# EAGLE design mLRS-tx-dualE22-top-v031 (EAGLE 7.5.0)
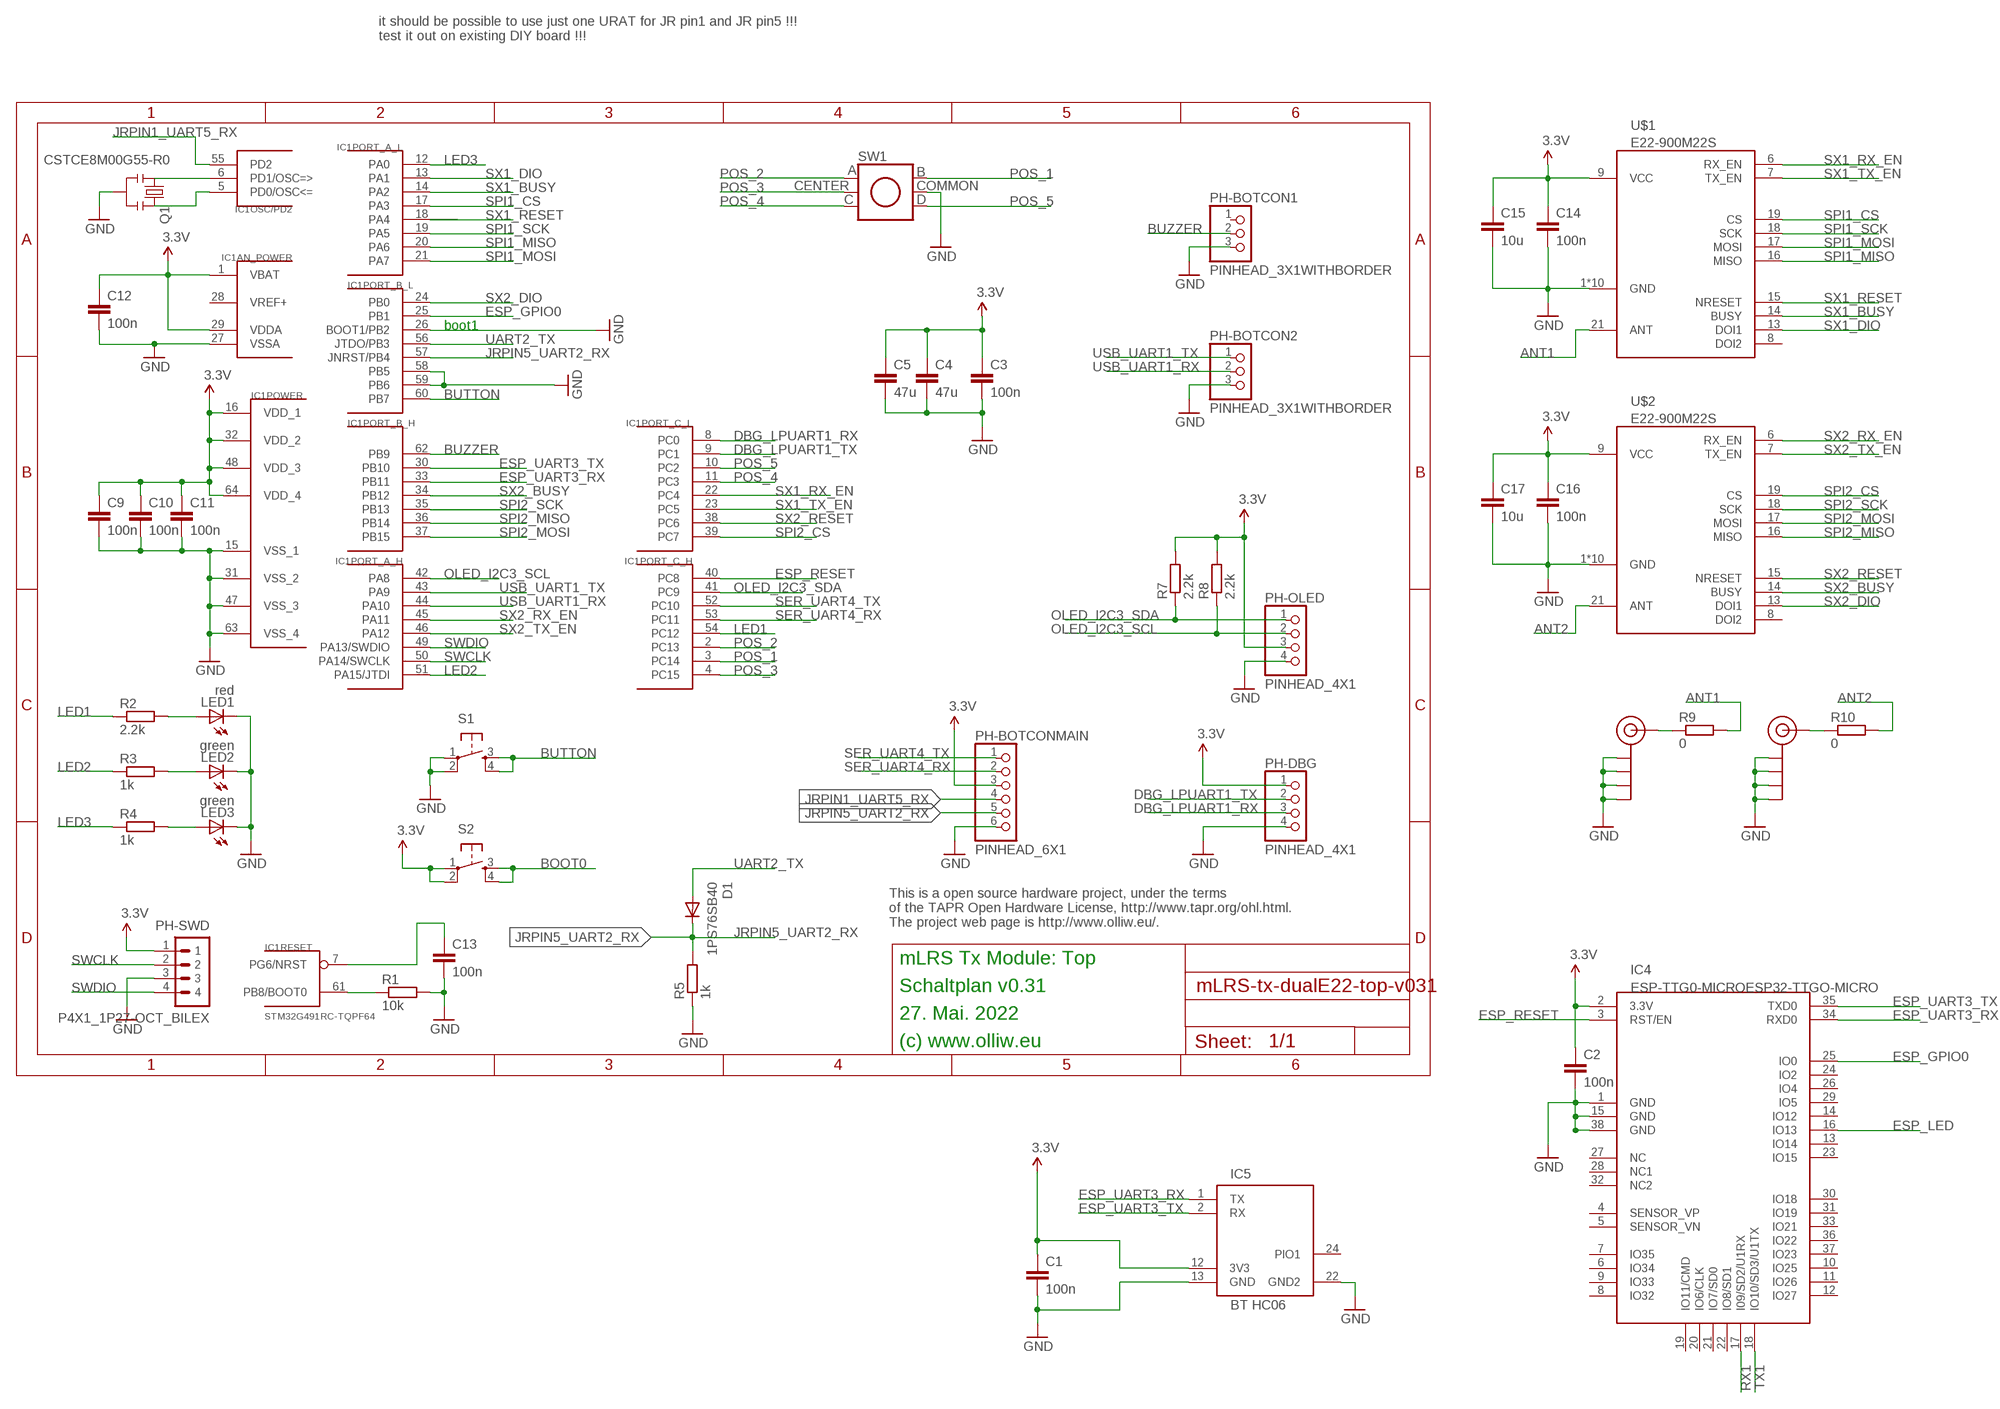
[diagram p0: schematic, sheet 1]

## Parts
C1  100n  C-EUC0603  [C0603]
C2  100n  C-EUC0603  [C0603]
C3  100n  C-EUC0402  [C0402]
C4  47u  C-EUC1210  [C1210]
C5  47u  C-EUC1206K  [C1206K]
C9  100n  C-EUC0402  [C0402]
C10  100n  C-EUC0402  [C0402]
C11  100n  C-EUC0402  [C0402]
C12  100n  C-EUC0402  [C0402]
C13  100n  C-EUC0402  [C0402]
C14  100n  C-EUC0402  [C0402]
C15  10u  C-EUC0603  [C0603]
C16  100n  C-EUC0402  [C0402]
C17  10u  C-EUC0603  [C0603]
D1  1PS76SB40  DIODE-SOD110-R  [SOD110-R]
IC1  STM32G491RC-TQPF64  STM32G4X1RX-TQPF64  [TQFP64]
IC4  ESP-TTG0-MICROESP32-TTGO-MICRO  [ESP32-TTGO-MICRO]
IC5  BT HC06  HC06-BASIC  [BT_HC05_BASIC]
LED1  red  LEDCHIPLED_0603  [CHIPLED_0603]
LED2  green  LEDCHIPLED_0603  [CHIPLED_0603]
LED3  green  LEDCHIPLED_0603  [CHIPLED_0603]
PH-BOTCON1  PINHEAD_3X1WITHBORDER  [PINHEAD_3X1]
PH-BOTCON2  PINHEAD_3X1WITHBORDER  [PINHEAD_3X1]
PH-BOTCONMAIN  PINHEAD_6X1  [PINHEAD_6X1]
PH-DBG  PINHEAD_4X1  [PINHEAD_4X1]
PH-OLED  PINHEAD_4X1  [PINHEAD_4X1]
PH-SWD  P4X1_1P27-OCT_BILEX  [4X1_1P27_OCT_BILEX]
Q1  CSTCE8M00G55-R0  RESONATORSMD  [RESONATOR-SMD]
R1  10k  R-EU_R0402  [R0402]
R2  2.2k  R-EU_R0402  [R0402]
R3  1k  R-EU_R0402  [R0402]
R4  1k  R-EU_R0402  [R0402]
R5  1k  R-EU_R0402  [R0402]
R7  2.2k  R-EU_R0402  [R0402]
R8  2.2k  R-EU_R0402  [R0402]
R9  0  R-EU_R0402  [R0402]
R10  0  R-EU_R0402  [R0402]
RF1  SMA_EDGE  [SMA-EDGE]
RF2  SMA_EDGE  [SMA-EDGE]
S1  TAC_SWITCHPTH  [TACTILE-PTH]
S2  TAC_SWITCHPTH  [TACTILE-PTH]
SW1  JOYSTICK-5WAY  [JOYSTICK-5WAY]
U$1  E22-900M22S  [E22-900M22S]
U$2  E22-900M22S  [E22-900M22S]

## Nets
3.3V: C1.1 C2.1 C3.1 C4.1 C5.1 C9.1 C10.1 C11.1 C12.1 C14.1 C15.1 C16.1 C17.1 IC1.1(AN_POWER:VBAT) IC1.16(POWER:VDD_1) IC1.29(AN_POWER:VDDA) IC1.32(POWER:VDD_2) IC1.48(POWER:VDD_3) IC1.64(POWER:VDD_4) IC4.2(3.3V) IC5.12(3V3) PH-BOTCONMAIN.3 PH-DBG.1 PH-OLED.3 PH-SWD.1 R7.2 R8.2 S2.1 S2.2 U$1.9(VCC) U$2.9(VCC)
ANT1: R9.2 U$1.21(ANT)
ANT2: R10.2 U$2.21(ANT)
BOOT0: IC1.61(RESET:PB8/BOOT0) R1.1 S2.3 S2.4
BUTTON: IC1.60(PORT_B_L:PB7) S1.3 S1.4
BUZZER: IC1.62(PORT_B_H:PB9) PH-BOTCON1.2
DBG_LPUART1_RX: IC1.8(PORT_C_L:PC0) PH-DBG.3
DBG_LPUART1_TX: IC1.9(PORT_C_L:PC1) PH-DBG.2
ESP_GPIO0: IC1.25(PORT_B_L:PB1) IC4.25(IO0)
ESP_LED: IC4.16(IO13)
ESP_RESET: IC1.40(PORT_C_H:PC8) IC4.3(RST/EN)
ESP_UART3_RX: IC1.33(PORT_B_H:PB11) IC4.34(RXD0) IC5.1(TX)
ESP_UART3_TX: IC1.30(PORT_B_H:PB10) IC4.35(TXD0) IC5.2(RX)
GND: C1.2 C2.2 C3.2 C4.2 C5.2 C9.2 C10.2 C11.2 C12.2 C13.2 C14.2 C15.2 C16.2 C17.2 IC1.15(POWER:VSS_1) IC1.26(PORT_B_L:BOOT1/PB2) IC1.27(AN_POWER:VSSA) IC1.31(POWER:VSS_2) IC1.47(POWER:VSS_3) IC1.58(PORT_B_L:PB5) IC1.59(PORT_B_L:PB6) IC1.63(POWER:VSS_4) IC4.1(GND) IC4.15(GND) IC4.38(GND) IC5.13(GND) IC5.22(GND2) LED1.C LED2.C LED3.C PH-BOTCON1.3 PH-BOTCON2.3 PH-BOTCONMAIN.6 PH-DBG.4 PH-OLED.4 PH-SWD.3 Q1.2 R1.2 R5.1 RF1.GND@0(GND) RF1.GND@1(GND) RF1.GND@2(GND) RF1.GND@3(GND) RF2.GND@0(GND) RF2.GND@1(GND) RF2.GND@2(GND) RF2.GND@3(GND) S1.1 S1.2 SW1.5(COMMON) U$1.1(GND) U$1.2(GND) U$1.3(GND) U$1.4(GND) U$1.5(GND) U$1.10(GND) U$1.11(GND) U$1.12(GND) U$1.20(GND) U$1.22(GND) U$2.1(GND) U$2.2(GND) U$2.3(GND) U$2.4(GND) U$2.5(GND) U$2.10(GND) U$2.11(GND) U$2.12(GND) U$2.20(GND) U$2.22(GND)
JRPIN1_UART5_RX: IC1.55(OSC/PD2:PD2) PH-BOTCONMAIN.4
JRPIN5_UART2_RX: D1.C IC1.57(PORT_B_L:JNRST/PB4) PH-BOTCONMAIN.5 R5.2
LED1: IC1.54(PORT_C_H:PC12) R2.1
LED2: IC1.51(PORT_A_H:PA15/JTDI) R3.1
LED3: IC1.12(PORT_A_L:PA0) R4.1
N$1: R9.1 RF1.SIG(SIGNAL)
N$2: R10.1 RF2.SIG(SIGNAL)
N$4: LED1.A R2.2
N$5: C13.1 IC1.7(RESET:PG6/NRST)
N$8: LED2.A R3.2
N$9: LED3.A R4.2
N$12: IC1.5(OSC/PD2:PD0/OSC<=) Q1.3
N$14: IC1.6(OSC/PD2:PD1/OSC=>) Q1.1
OLED_I2C3_SCL: IC1.42(PORT_A_H:PA8) PH-OLED.2 R8.1
OLED_I2C3_SDA: IC1.41(PORT_C_H:PC9) PH-OLED.1 R7.1
POS_1: IC1.3(PORT_C_H:PC14) SW1.4(B)
POS_2: IC1.2(PORT_C_H:PC13) SW1.1(A)
POS_3: IC1.4(PORT_C_H:PC15) SW1.2(CENTER)
POS_4: IC1.11(PORT_C_L:PC3) SW1.3(C)
POS_5: IC1.10(PORT_C_L:PC2) SW1.6(D)
RX1: IC4.17(I09/SD2/U1RX)
SER_UART4_RX: IC1.53(PORT_C_H:PC11) PH-BOTCONMAIN.2
SER_UART4_TX: IC1.52(PORT_C_H:PC10) PH-BOTCONMAIN.1
SPI1_CS: IC1.17(PORT_A_L:PA3) U$1.19(CS)
SPI1_MISO: IC1.20(PORT_A_L:PA6) U$1.16(MISO)
SPI1_MOSI: IC1.21(PORT_A_L:PA7) U$1.17(MOSI)
SPI1_SCK: IC1.19(PORT_A_L:PA5) U$1.18(SCK)
SPI2_CS: IC1.39(PORT_C_L:PC7) U$2.19(CS)
SPI2_MISO: IC1.36(PORT_B_H:PB14) U$2.16(MISO)
SPI2_MOSI: IC1.37(PORT_B_H:PB15) U$2.17(MOSI)
SPI2_SCK: IC1.35(PORT_B_H:PB13) U$2.18(SCK)
SWCLK: IC1.50(PORT_A_H:PA14/SWCLK) PH-SWD.2
SWDIO: IC1.49(PORT_A_H:PA13/SWDIO) PH-SWD.4
SX1_BUSY: IC1.14(PORT_A_L:PA2) U$1.14(BUSY)
SX1_DIO: IC1.13(PORT_A_L:PA1) U$1.13(DOI1)
SX1_RESET: IC1.18(PORT_A_L:PA4) U$1.15(NRESET)
SX1_RX_EN: IC1.22(PORT_C_L:PC4) U$1.6(RX_EN)
SX1_TX_EN: IC1.23(PORT_C_L:PC5) U$1.7(TX_EN)
SX2_BUSY: IC1.34(PORT_B_H:PB12) U$2.14(BUSY)
SX2_DIO: IC1.24(PORT_B_L:PB0) U$2.13(DOI1)
SX2_RESET: IC1.38(PORT_C_L:PC6) U$2.15(NRESET)
SX2_RX_EN: IC1.45(PORT_A_H:PA11) U$2.6(RX_EN)
SX2_TX_EN: IC1.46(PORT_A_H:PA12) U$2.7(TX_EN)
TX1: IC4.18(IO10/SD3/U1TX)
UART2_TX: D1.A IC1.56(PORT_B_L:JTDO/PB3)
USB_UART1_RX: IC1.44(PORT_A_H:PA10) PH-BOTCON2.2
USB_UART1_TX: IC1.43(PORT_A_H:PA9) PH-BOTCON2.1
Unconnected: IC1.28(AN_POWER:VREF+) IC4.4(SENSOR_VP) IC4.5(SENSOR_VN) IC4.6(IO34) IC4.7(IO35) IC4.8(IO32) IC4.9(IO33) IC4.10(IO25) IC4.11(IO26) IC4.12(IO27) IC4.13(IO14) IC4.14(IO12) IC4.19(IO11/CMD) IC4.20(IO6/CLK) IC4.21(IO7/SD0) IC4.22(IO8/SD1) IC4.23(IO15) IC4.24(IO2) IC4.26(IO4) IC4.27(NC) IC4.28(NC1) IC4.29(IO5) IC4.30(IO18) IC4.31(IO19) IC4.32(NC2) IC4.33(IO21) IC4.36(IO22) IC4.37(IO23) IC5.24(PIO1) PH-BOTCON1.1 U$1.8(DOI2) U$2.8(DOI2)

## Notes on the sheet
- it should be possible to use just one URAT for JR pin1 and JR pin5 !!!
  test it out on existing DIY board !!!
- boot1
- This is a open source hardware project, under the terms
  of the TAPR Open Hardware License, http://www.tapr.org/ohl.html.
  The project web page is http://www.olliw.eu/.
- mLRS Tx Module: Top
- Schaltplan v0.31
- 27. Mai. 2022
- (c) www.olliw.eu

## Library data of the parts
C1-C5 C9-C17 = rcl:C-EU: CAPACITOR, European symbol
D1 = diode:DIODE-: DIODE
IC1 = # stm32:STM32G4X1RX
IC4 = # stdlib:ESP-TTG0-MICRO
IC5 = # SerialPortBluetooth:HC06-BASIC
LED1-LED3 = led:LED: LED OSRAM: - CHIPLED LG R971, LG N971, LY N971, LG Q971, LY Q971, LO R971, LY R971 LH N974, LH R974 LS Q976, LO Q976, LY Q976 LO Q996 - Hyper CHIPLED LW Q18S LB Q993, LB Q99A, LB R99A - SideLED LS A670, LO A670, LY A670, LG A670, LP A670 LB A673, LV A673, LT A673, LW A673 LH A674 LY A675 LS A676, LA A676, LO A676, LY A676, LW A676 LS A679, LY A679, LG A679 - Hyper Micro SIDELED® LS Y876, LA Y876, LO Y876, LY Y876 LT Y87S - SmartLED LW L88C, LW L88S LB L89C, LB L89S, LG L890 LS L89K, LO L89K, LY L89K LS L896, LA L896, LO L896, LY L896 - TOPLED LS T670, LO T670, LY T670, LG T670, LP T670 LSG T670, LSP T670, LSY T670, LOP T670, LYG T670 LG T671, LOG T671, LSG T671 LB T673, LV T673, LT T673, LW T673 LH T674 LS T676, LA T676, LO T676, LY T676, LB T676, LH T676, LSB T676, LW T676 LB T67C, LV T67C, LT T67C, LS T67K, LO T67K, LY T67K, LW E67C LS E67B, LA E67B, LO E67B, LY E67B, LB E67C, LV E67C, LT E67C LW T67C LS T679, LY T679, LG T679 LS T770, LO T770, LY T770, LG T770, LP T770 LB T773, LV T773, LT T773, LW T773 LH T774 LS E675, LA E675, LY E675, LS T675 LS T776, LA T776, LO T776, LY T776, LB T776 LHGB T686 LT T68C, LB T68C - Hyper Mini TOPLED® LB M676 - Mini TOPLED Santana® LG M470 LS M47K, LO M47K, LY M47K Source: http://www.osram.convergy.de LUXEON: - LUMILED® LXK2-PW12-R00, LXK2-PW12-S00, LXK2-PW14-U00, LXK2-PW14-V00 LXK2-PM12-R00, LXK2-PM12-S00, LXK2-PM14-U00 LXK2-PE12-Q00, LXK2-PE12-R00, LXK2-PE12-S00, LXK2-PE14-T00, LXK2-PE14-U00 LXK2-PB12-K00, LXK2-PB12-L00, LXK2-PB12-M00, LXK2-PB14-N00, LXK2-PB14-P00, LXK2-PB14-Q00 LXK2-PR12-L00, LXK2-PR12-M00, LXK2-PR14-Q00, LXK2-PR14-R00 LXK2-PD12-Q00, LXK2-PD12-R00, LXK2-PD12-S00 LXK2-PH12-R00, LXK2-PH12-S00 LXK2-PL12-P00, LXK2-PL12-Q00, LXK2-PL12-R00 Source: www.luxeon.com KINGBRIGHT: KA-3528ASYC Source: www.kingbright.com
PH-BOTCON1 PH-BOTCON2 = # stdlib:PINHEAD_3X1
PH-BOTCONMAIN = # stdlib:PINHEAD_6X1
PH-DBG PH-OLED = # stdlib:PINHEAD_4X1
PH-SWD = # stdlib:P4X1_1P27
Q1 = # SparkFun2:RESONATOR: Resonator Small SMD resonator. This is the itty bitty 10/20MHz resonators with built in caps. CSTCE10M0G55 and CSTCE20M0V53. Footprint has been reviewed closely but hasn't been tested yet.
R1-R5 R7-R10 = rcl:R-EU_: RESISTOR, European symbol
RF1 RF2 = # SparkFun2:SMA_EDGE: SMA Antenna Connector End launch SMA connector. The paste layer has been removed so that the connector can be hand soldered onto the board after reflow.
S1 S2 = # SparkFun2:TAC_SWITCH: Momentary Switch Button commonly used for reset or general input. Spark Fun Electronics SKU : COM-00097
SW1 = # stdlib:JOYSTICK-5WAY
U$1 U$2 = # stdlib:E22-900M22S

## Board
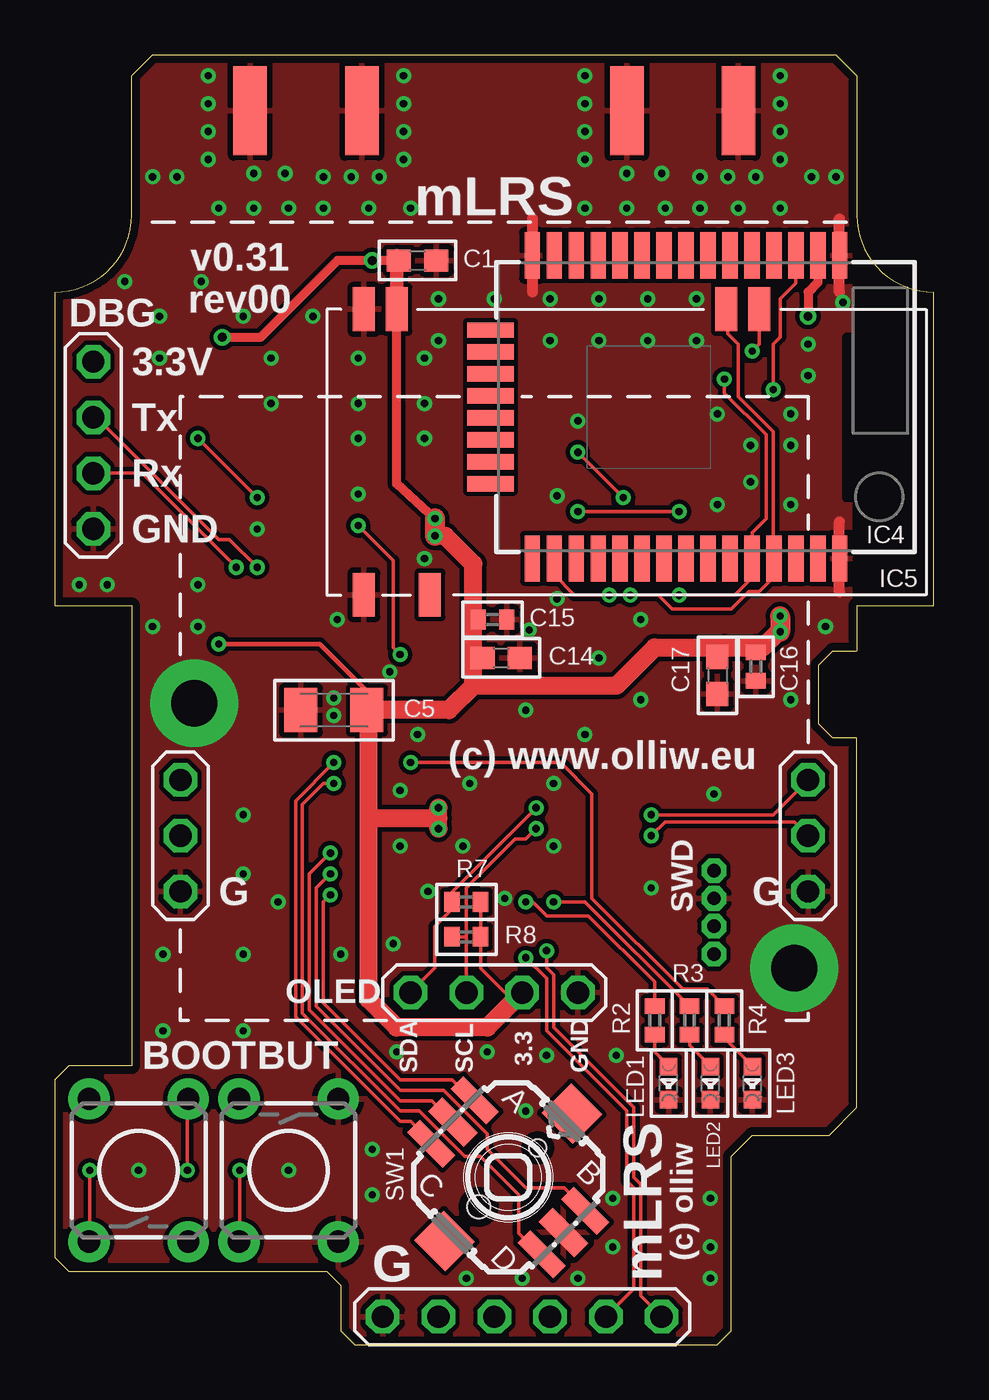
[diagram p1: board, top side]
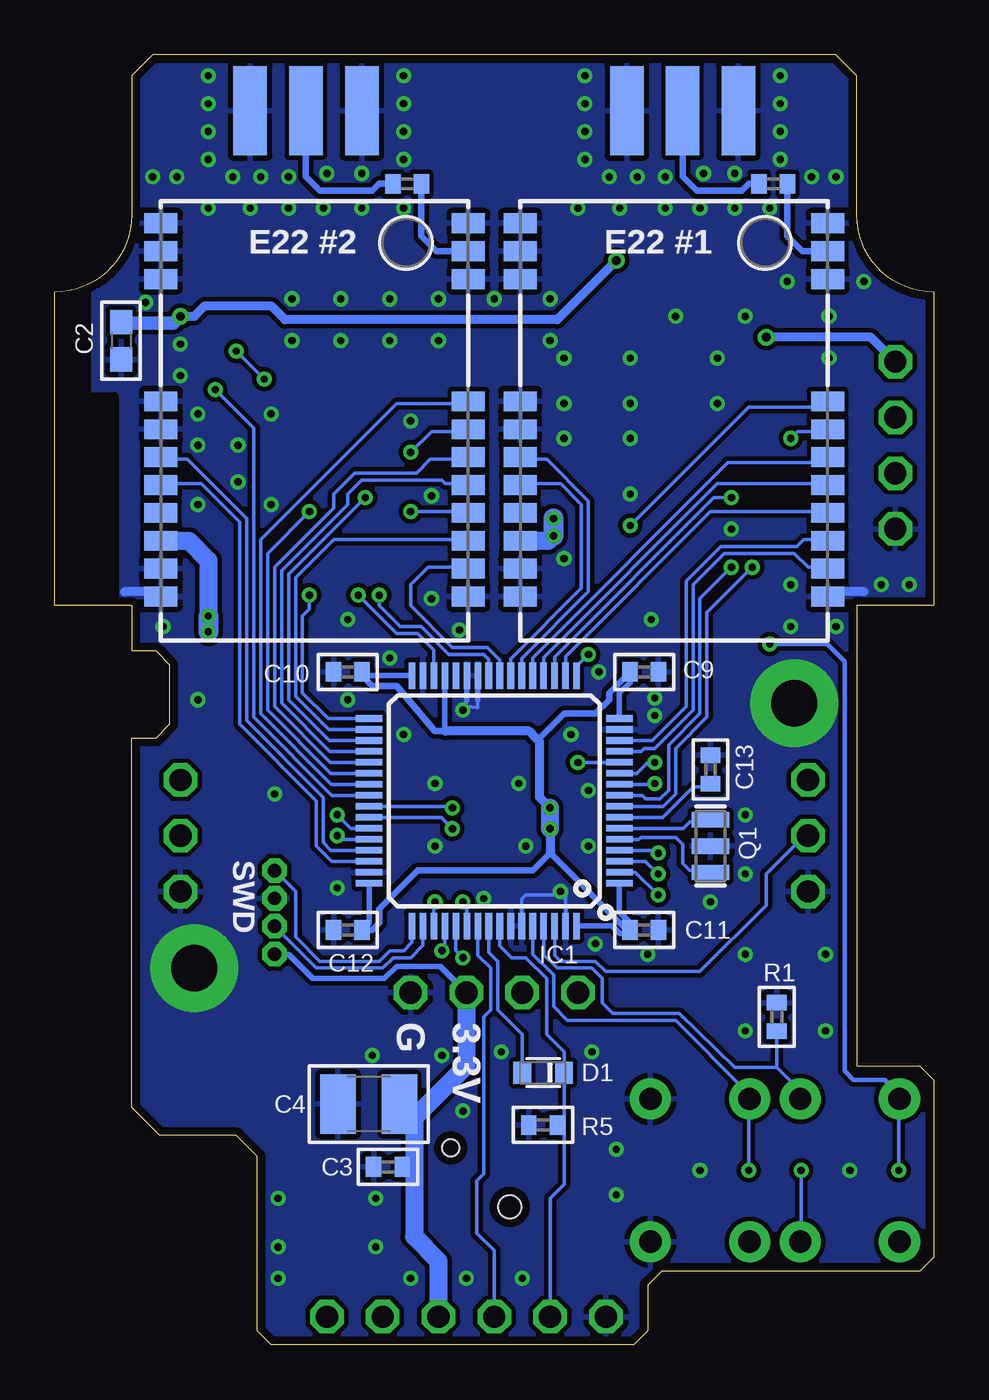
[diagram p2: board, bottom side, seen from below]

Size 40.01 x 58.74 mm. Coordinates in mm from the lower left corner, seen from the top.
Outline: 36.51,10.79 36.51,27.62 35.4,27.62 34.77,28.26 34.77,30.96 35.4,31.59 36.51,31.59 36.51,33.66 40.01,33.66 40.01,47.94 arc-90 36.51,51.44 36.51,57.78 35.56,58.74 4.45,58.74 3.49,57.78 3.49,51.44 arc-90 0,47.94 0,33.66 3.49,33.66 3.49,12.7 0.64,12.7 0,12.07 0,3.97 0.64,3.33 12.38,3.33 13.02,2.7 13.02,0.63 13.65,0 30.16,0 30.8,0.63 30.8,8.57 31.75,9.53 35.24,9.53 36.51,10.79
Copper layers (1*16): Top 0.0356mm / dielectric 1.5011mm / Bottom 0.0356mm
Design rules "ow-oshpark-2layer": minimum track width 6mil, minimum drill 13mil, track to track 6mil, track to pad 6mil, pad to pad 6mil, via to via 6mil, smd to smd 6mil, copper to edge 15mil, drill to drill 6mil, minimum pad ring 7mil, minimum via ring 7mil, stop-mask expansion 2.5mil, vias tented up to drill 26mil, thermal gap 10mil
tRestrict: area 36.5,33.8 to 39.4,49.7; area 36,38.6 to 38.4,45.9
bRestrict: area 38.6,33.3 to 39.5,49.5; area 37.3,33.2 to 38.6,43.2

### Footprints (pad centres in the part's own frame; a part is rotated, then mirrored left to right if it is on the bottom)
C0603 = smd 1.1 x 1: 1 -0.85,0; 2 0.85,0
C0402 = smd 0.7 x 0.9: 1 -0.65,0; 2 0.65,0
C1210 = smd 1.6 x 2.7: 1 -1.4,0; 2 1.4,0
C1206K = smd 1.5 x 2: 1 -1.5,0; 2 1.5,0
SOD110-R = smd 0.8 x 1: A 0.95,0; C -0.95,0
TQFP64 = smd 1.2 x 0.3: 1 -5.7,3.75; 2 -5.7,3.25; 3 -5.7,2.75; 4 -5.7,2.25; 5 -5.7,1.75; 6 -5.7,1.25; 7 -5.7,0.75; 8 -5.7,0.25; 9 -5.7,-0.25; 10 -5.7,-0.75; 11 -5.7,-1.25; 12 -5.7,-1.75; 13 -5.7,-2.25; 14 -5.7,-2.75; 15 -5.7,-3.25; 16 -5.7,-3.75; 33 5.7,-3.75; 34 5.7,-3.25; 35 5.7,-2.75; 36 5.7,-2.25; 37 5.7,-1.75; 38 5.7,-1.25; 39 5.7,-0.75; 40 5.7,-0.25; 41 5.7,0.25; 42 5.7,0.75; 43 5.7,1.25; 44 5.7,1.75; 45 5.7,2.25; 46 5.7,2.75; 47 5.7,3.25; 48 5.7,3.75 | smd 0.3 x 1.2: 17 -3.75,-5.7; 18 -3.25,-5.7; 19 -2.75,-5.7; 20 -2.25,-5.7; 21 -1.75,-5.7; 22 -1.25,-5.7; 23 -0.75,-5.7; 24 -0.25,-5.7; 25 0.25,-5.7; 26 0.75,-5.7; 27 1.25,-5.7; 28 1.75,-5.7; 29 2.25,-5.7; 30 2.75,-5.7; 31 3.25,-5.7; 32 3.75,-5.7; 49 3.75,5.7; 50 3.25,5.7; 51 2.75,5.7; 52 2.25,5.7; 53 1.75,5.7; 54 1.25,5.7; 55 0.75,5.7; 56 0.25,5.7; 57 -0.25,5.7; 58 -0.75,5.7; 59 -1.25,5.7; 60 -1.75,5.7; 61 -2.25,5.7; 62 -2.75,5.7; 63 -3.25,5.7; 64 -3.75,5.7
ESP32-TTGO-MICRO = smd 2.1 x 0.7: 1 -6.9,7; 2 -6.9,6; 3 -6.9,5; 4 -6.9,4; 5 -6.9,3; 6 -6.9,2; 7 -6.9,1; 8 -6.9,0; 9 -6.9,-1; 10 -6.9,-2; 11 -6.9,-3; 12 -6.9,-4; 13 -6.9,-5; 14 -6.9,-6; 15 -6.9,-7; 24 6.9,-7; 25 6.9,-6; 26 6.9,-5; 27 6.9,-4; 28 6.9,-3; 29 6.9,-2; 30 6.9,-1; 31 6.9,0; 32 6.9,1; 33 6.9,2; 34 6.9,3; 35 6.9,4; 36 6.9,5; 37 6.9,6; 38 6.9,7 | smd 0.7 x 2.1: 16 -3.5,-8.9; 17 -2.5,-8.9; 18 -1.5,-8.9; 19 -0.5,-8.9; 20 0.5,-8.9; 21 1.5,-8.9; 22 2.5,-8.9; 23 3.5,-8.9
BT_HC05_BASIC = smd 2 x 1: 1 0,0; 2 0,-1.5; 12 0,-16.5; 13 0,-18; 22 13,-18; 24 13,-15
CHIPLED_0603 = smd 0.8 x 0.8: A 0,-0.75; C 0,0.75
PINHEAD_3X1 = drill 1.016 octagon: 1 0,0; 2 0,-2.54; 3 0,-5.08
PINHEAD_6X1 = drill 1.016 octagon: 1 0,12.7; 2 0,10.16; 3 0,7.62; 4 0,5.08; 5 0,2.54; 6 0,0
PINHEAD_4X1 = drill 1.016 octagon: 1 0,7.62; 2 0,5.08; 3 0,2.54; 4 0,0
4X1_1P27_OCT_BILEX = drill 0.61 pad 1.118 octagon: 1 0,0; 2 0,-1.27; 3 0,-2.54; 4 0,-3.81
RESONATOR-SMD = smd 0.7 x 1.7: 1 -1.2,0; 2 0,0; 3 1.2,0
R0402 = smd 0.7 x 0.9: 1 -0.65,0; 2 0.65,0
SMA-EDGE = smd 1.524 x 4.064: GND@0 0,0; GND@1 5.08,0; SIG 2.54,0 | smd 1.524 x 4.064 bottom: GND@2 0,0; GND@3 5.08,0
TACTILE-PTH = drill 1.016 pad 1.88: 1 -3.251,2.261; 2 3.251,2.261; 3 -3.251,-2.261; 4 3.251,-2.261
JOYSTICK-5WAY = smd 2.286 x 0.813: 1 -3.556,1.4; 3 -3.556,-1.4; 4 3.556,1.4; 6 3.556,-1.4 | smd 2.286 x 0.914: 2 -3.556,0; 5 3.556,0 | smd 2 x 1.9: S 0,4.1; T 0,-4.1 | hole 0.75: 0,1.9 | hole 1.05: 0,-1.9
E22-900M22S = smd 1.5 x 0.9: 1 -7,9; 2 -7,7.73; 3 -7,6.46; 4 -7,0.89; 5 -7,-0.38; 6 -7,-1.65; 7 -7,-2.92; 8 -7,-4.19; 9 -7,-5.46; 10 -7,-6.73; 11 -7,-8; 12 7,-8; 13 7,-6.73; 14 7,-5.46; 15 7,-4.19; 16 7,-2.92; 17 7,-1.65; 18 7,-0.38; 19 7,0.89; 20 7,6.46; 21 7,7.73; 22 7,9

### Placement (x,y rotation side)
C1  16.51,49.37 0 top
C2  36.99,45.72 270 bottom
C3  24.84,8.1 180 bottom
C4  25.72,10.95 180 bottom
C5  12.7,28.89 180 top
C9  13.18,30.64 0 bottom
C10  26.67,30.64 180 bottom
C11  13.18,18.89 0 bottom
C12  26.67,18.89 180 bottom
C13  10.16,26.19 90 bottom
C14  19.92,33.02 0 top
C15  20.32,31.27 0 top
C16  31.91,30.88 270 top
C17  30.16,30.48 270 top
D1  17.78,12.38 180 bottom
IC1  20,24.77 180 bottom
IC4  28.73,42.7 270 top
IC5  32.07,47.15 270 top
LED1  27.94,11.91 180 top
LED2  29.84,11.91 180 top
LED3  31.75,11.91 180 top
PH-BOTCON1  5.71,25.72 0 top
PH-BOTCON2  34.29,25.72 0 top
PH-BOTCONMAIN  14.92,1.27 270 top
PH-DBG  1.75,37.15 0 top
PH-OLED  23.81,16.03 90 top
PH-SWD  30,17.78 180 top
Q1  10.16,22.7 270 bottom
R1  7.14,14.92 90 bottom
R2  27.3,14.76 270 top
R3  28.89,14.76 270 top
R4  30.48,14.76 270 top
R5  17.78,10 0 bottom
R7  18.73,20.16 0 top
R8  18.73,18.57 0 top
R9  7.3,52.86 0 bottom
R10  23.97,52.86 0 bottom
RF1  13.97,56.2 0 bottom
RF2  31.11,56.2 0 bottom
S1  10.64,7.94 270 top
S2  3.81,7.94 90 top
SW1  20.64,7.62 315 top
U$1  11.83,42.07 0 bottom
U$2  28.18,42.07 0 bottom

### Tracks (layer width: path | path; a pad name or v marks a point on that pad's centre or on a via)
3.3V  (via drill 0.33, 0.4)
  Top 0.152: PH-OLED.3 20.48,16.03 19.38,17.13 R8.2 R7.2 | v1.59,7.94 1.59,4.72 S2.1
  Top 0.203: 14.29,29.69 12.06,31.91 v7.46,31.91
  Top 0.406: 14.29,29.69 14.29,28.73 | 15.57,49.6 C1.1 v14.45,49.37 12.86,49.37 9.37,45.88 v7.62,45.88 | IC5.12 15.56,46.82 15.56,39.21 v17.3,37.62 | IC4.2 34.73,48.39 34.29,47.94 v34.29,46.83
  Top 0.61: IC5.12 15.57,49.6 | C5.1 14.2,28.65 14.29,28.73 | C17.1 30.32,31.59 30.48,31.75 | C16.1 31.91,31.75 | C14.1 19.05,33.02 | C15.1 19.21,31.27 19.05,31.43
  Top 0.813: PH-OLED.3 19.68,14.45 15.56,14.45 14.29,15.72 14.29,23.97 | 14.29,23.97 14.29,28.73 14.3,28.73 14.3,28.89 17.94,28.89 19.05,30 | 17.46,23.97 v17.46,24.45 | v17.46,23.5 17.46,23.97 | 17.46,23.97 14.29,23.97 | 33.02,32.54 32.23,31.75 31.91,31.75 30.48,31.75 27.3,31.75 25.56,30 19.05,30 | 19.05,30 19.05,31.43 19.05,33.02 19.05,35.56 17.78,36.83 v17.3,36.83
  Top 0.914: v17.3,37.62 v17.3,36.83 | v33.02,33.18 33.02,32.54 v33.02,32.46
  Bottom 0.152: S2.2 1.55,11.15 1.59,11.11 | 1.59,11.11 v1.59,7.94 | 1.59,11.11 1.59,11.43
  Bottom 0.203: 1.59,11.43 2.22,12.07 3.65,12.07 4.05,12.46 4.05,31.12 4.84,31.91 v7.46,31.91
  Bottom 0.254: IC1.1 14.3,19.7 13.81,19.21 13.81,18.88 C11.1 13.97,18.73 14.29,18.73 14.62,19.07 IC1.64 | IC1.48 25.7,19.21 C12.1 | PH-SWD.1 29.37,17.78 28.26,16.67 25,16.67 24.45,17.22 22.46,17.22 PH-OLED.3 | IC1.32 26,30.46 C10.1 | IC1.29 22.25,27.97 22.22,27.94 | 13.81,30.64 13.83,30.65 C9.1 13.81,30.78 13.81,30.16 14.3,29.67 IC1.16
  Bottom 0.305: C9.1 13.97,30.48 14.76,29.69 14.76,29.37 15.4,28.73 16.83,28.73 18.02,27.54 | C10.1 26.02,30.46 25.56,30 24.45,30 22.7,27.94 22.22,27.94 | C12.1 25.56,18.89 25.24,19.21 25.24,19.84 23.49,21.59 18.26,21.59 17.46,22.38 13.81,18.73 C11.1
  Bottom 0.406: v34.29,46.83 33.66,46.83 33.18,47.31 30.16,47.31 29.53,46.67 17.14,46.67 v14.45,49.37 | v17.46,23.5 17.46,22.38 | v17.46,24.45 17.94,24.92 17.94,27.46 18.02,27.54 18.41,27.94 22.22,27.94 | PH-DBG.1 2.86,45.88 v7.62,45.88
  Bottom 0.61: C2.1 36.99,46.51 34.61,46.51 v34.29,46.83 | C4.1 23.97,10.95 23.65,10.32 | C3.1 23.65,8.25
  Bottom 0.813: PH-OLED.3 21.27,12.7 23.65,10.32 23.65,8.25 23.65,4.92 22.54,3.81 PH-BOTCONMAIN.3 | v17.46,23.5 v17.46,24.45 | U$2.9 33.91,36.61 33.02,35.72 33.02,32.86 | U$1.9 17.52,36.61 v17.3,36.83
  Bottom 0.914: v17.3,36.83 v17.3,37.62 | v33.02,33.18 33.02,32.86 v33.02,32.46
ANT1
  Bottom 0.305: U$1.21 5.98,49.8 6.67,50.48 6.67,52.72 R9.2
ANT2
  Bottom 0.305: U$2.21 22.65,49.8 23.34,50.48 23.34,52.85 R10.2
BOOT0  (via drill 0.33)
  Top 0.152: S2.4 6.07,11.15 6.03,11.11 v6.03,7.94
  Bottom 0.152: IC1.61 17.75,17.75 17.14,17.14 15.56,17.14 15.08,16.67 15.08,15.56 14.61,15.08 11.59,15.08 9.05,12.62 7.14,12.62 | v6.03,7.94 6.03,4.72 S2.3 | 7.14,12.62 R1.1 | S2.4 6.07,11.55 7.14,12.62
BUTTON  (via drill 0.33)
  Top 0.152: v8.41,7.94 8.41,4.72 S1.4
  Bottom 0.152: IC1.60 18.25,17.78 17.3,16.83 17.3,15.4 16.67,14.76 11.75,14.76 8.57,11.59 8.57,11.39 S1.3 8.38,11.15 8.41,11.11 v8.41,7.94
BUZZER
  Bottom 0.152: IC1.62 17.25,17.73 16.99,17.46 15.4,17.46 14.92,16.99 10.64,16.99 7.62,20 7.62,21.43 5.87,23.18 PH-BOTCON1.2
DBG_LPUART1_RX  (via drill 0.33)
  Top 0.152: PH-DBG.3 3.97,39.69 v8.26,35.4
  Bottom 0.152: IC1.8 12.31,24.52 11.75,25.08 11.75,27.15 10.32,28.58 10.32,33.34 v8.26,35.4
DBG_LPUART1_TX  (via drill 0.33)
  Top 0.152: v9.21,35.4 7.94,36.67 7.46,36.67 1.91,42.23 PH-DBG.2
  Bottom 0.152: v9.21,35.4 10.64,33.97 10.64,28.73 12.06,27.3 12.06,25.24 12.46,24.84 13.1,24.84 13.27,25.02 IC1.9
ESP_GPIO0  (via drill 0.33)
  Top 0.152: v25.24,34.13 23.65,34.13 22.7,35.08 22.7,35.77 IC4.25
  Bottom 0.152: v25.24,34.13 25.24,33.66 24.29,32.7 23.34,32.7 22.07,31.43 20.48,31.43 20.25,31.21 IC1.25
ESP_RESET  (via drill 0.33)
  Top 0.152: v32.7,43.5 32.7,45.56 33.02,45.88 33.02,47.62 33.73,48.34 IC4.3
  Bottom 0.152: v32.7,43.5 30.96,41.75 30.96,28.58 27.4,25.02 IC1.40
ESP_UART3_RX  (via drill 0.33)
  Top 0.152: v28.42,34.13 30.96,34.13 31.73,34.91 IC4.34 31.73,35.86 31.75,35.88 31.75,36.99 32.39,37.62 32.39,41.43 30.48,43.34 v30.48,43.97 | v31.75,45.24 32.07,45.56 IC5.1
  Bottom 0.152: v28.42,34.13 28.42,33.5 28.73,33.18 28.73,29.69 27.56,28.52 IC1.33 | v30.48,43.97 v31.75,45.24
ESP_UART3_TX  (via drill 0.33)
  Top 0.152: v26.19,34.13 27.46,34.13 28.1,33.5 30.8,33.5 31.59,34.29 32.07,34.29 32.73,34.96 IC4.35 32.73,35.85 32.7,35.88 32.7,41.59 31.11,43.18 31.11,45.56 30.64,46.04 30.64,47.08 IC5.2
  Bottom 0.152: IC1.30 22.75,31.64 23.49,32.38 24.45,32.38 v26.19,34.13
GND  (via drill 0.33, 2.1 pad 4)
  Top 0.508: 35.72,34.29 35.72,37.46 | 35.72,47.94 35.72,51.28 | 21.75,47.94 21.75,51.28
  Bottom 0.152: v16.99,20.64 16.75,20.4 16.75,20 | IC1.26 20.75,29.01 21.27,29.05 21.27,29.23 21.26,30.8 | IC1.63 16.75,20.25 16.99,20.48 18.57,20.48 18.75,20.3 IC1.59
  Bottom 0.254: 20.75,30.8 20.75,29.37 | 21.26,30.8 21.26,29.37
  Bottom 0.406: 3.17,34.29 5.08,34.29 | 34.93,34.29 36.83,34.29
  other vias: 33.66,17.14 6.35,29.21 9.05,51.75 10.64,51.75 12.22,51.75 14.29,51.75 16.19,51.75 6.99,57.78 6.99,56.52 6.99,55.24 6.99,53.98 5.56,53.18 9.05,53.34 13.49,53.18 14.76,53.18 15.88,53.98 15.88,57.78 15.88,56.52 15.88,55.24 10.48,53.34 12.22,53.18 24.13,57.78 24.13,56.52 24.13,55.24 24.13,53.98 26.04,53.34 27.62,53.34 29.37,53.18 30.64,53.18 31.91,53.18 33.02,57.78 33.02,56.52 33.02,55.24 33.02,53.98 29.21,47.62 26.99,47.62 24.76,47.62 22.54,47.62 17.46,47.62 35.88,47.47 34.29,45.56 4.76,46.83 4.76,44.93 2.38,34.61 1.11,34.61 11.75,46.83 24.13,27.78 18.89,25.56 18.57,22.7 15.72,22.7 16.51,27.78 15.24,30.64 12.7,28.65 8.57,24.13 8.57,21.43 15.4,18.26 13.02,17.78 26.67,29.37 27.15,20.8 22.38,13.18 15.56,13.34 19.68,13.34 25.56,13.18 8.57,14.29 10.16,20.16 21.43,28.89 15.72,25.24 22.7,22.7 30,25.08 10.64,7.94 3.81,7.94 29.84,3.02 29.84,4.45 29.84,6.67 14.45,6.83 23.81,3.02 25.4,4.45 25.4,6.67 16.83,35.8 13.81,38.73 21.59,32.54 26.67,33.02 4.45,32.7 6.51,34.61 13.81,41.27 13.81,42.86 9.84,44.93 13.81,44.93 8.57,46.83 16.83,42.86 22.86,33.97 24.76,31.27 22.7,25.56 20.48,20.32 12.86,33.02 33.5,29.37 21.27,3.02 18.73,3.02 8.57,17.78 21.43,10.64 14.45,8.89 4.92,17.78 4.92,14.29 35.08,32.7 22.86,38.66 23.81,42.07 33.5,42.39 33.5,38.26 31.67,40.96 17.46,45.72 16.83,41.27 9.21,37.15 9.84,42.86 30.16,38.26 30.16,42.39 22.54,45.72 24.76,45.72 26.99,45.72 29.21,45.72 16.83,44.93 7.46,51.75 3.17,48.42 6.67,48.42 26.04,51.75 27.78,51.75 29.37,51.75 31.11,51.75 33.02,51.75 24.13,51.75 6.51,32.7 34.29,44.13 4.45,53.18 35.56,53.18 34.45,53.18 12.7,29.45 31.67,39.29 33.5,40.96 20,47.62
  pour Bottom (isolate 0.203, rank 6): -0.64,59.05 40.64,59.05 40.64,-0.32 -0.64,-0.32
  pour Top (isolate 0.203, rank 6): -0.64,59.05 40.64,59.05 40.64,-0.32 -0.64,-0.32
JRPIN1_UART5_RX
  Bottom 0.152: IC1.55 20.75,17.74 20.16,17.14 20.16,15.24 20.48,14.92 20.48,7.78 20.8,7.46 20.8,5.08 20,4.29 PH-BOTCONMAIN.4
JRPIN5_UART2_RX
  Bottom 0.152: IC1.57 19.75,18.16 19.21,17.62 18.57,17.62 17.62,16.67 17.62,14.13 16.83,13.34 16.83,12.23 | 16.83,12.23 D1.C | 16.83,12.23 16.83,9.68 | 16.83,9.68 16.83,7.3 17.46,6.67 PH-BOTCONMAIN.5 | R5.2 16.83,9.68
LED1  (via drill 0.33)
  Top 0.152: R2.1 27.3,16.51 24.29,19.53 22.38,19.53 21.75,20.16 v21.43,20.16
  Bottom 0.152: IC1.54 21.25,19.98 v21.43,20.16
LED2  (via drill 0.33)
  Top 0.152: R3.1 28.75,15.4 28.89,15.4 24.13,20.16 v22.7,20.16
  Bottom 0.152: v22.7,20.16 22.75,20.05 IC1.51
LED3  (via drill 0.33)
  Top 0.152: v16.19,26.51 23.02,26.51 24.45,25.08 24.45,20.32 28.57,16.19 29.7,16.19 R4.1
  Bottom 0.152: IC1.12 15.71,26.52 v16.19,26.51
N$1
  Bottom 0.305: R9.1 8.41,52.86 8.73,52.55 10.79,52.55 11.43,53.18 RF1.SIG
N$2
  Bottom 0.305: R10.1 25.24,52.86 25.56,52.55 27.94,52.55 28.57,53.18 RF2.SIG
N$4
  Top 0.152: R2.2 27.3,13.34 27.94,12.7 LED1.A
N$5
  Bottom 0.152: IC1.7 12.34,24.02 10.95,25.4 10.3,25.4 C13.1
N$8
  Top 0.152: R3.2 28.91,13.64 29.84,12.7 LED2.A
N$9
  Top 0.152: LED3.A 31.75,12.7 30.48,13.97 R4.2
N$12
  Bottom 0.152: IC1.5 13.42,23.02 13.34,23.1 11.74,23.09 11.43,22.78 11.43,21.91 11.11,21.59 10.25,21.59 Q1.3
N$14
  Bottom 0.152: IC1.6 11.41,23.52 11.11,23.81 10.25,23.81 Q1.1
OLED_I2C3_SCL  (via drill 0.33)
  Top 0.152: 18.73,18.57 18.73,20.8 20.95,23.02 21.43,23.02 v21.91,23.5 | 18.73,18.57 PH-OLED.2 | R8.1 18.73,18.57
  Bottom 0.152: IC1.42 22.43,24.02 v21.91,23.5
OLED_I2C3_SDA  (via drill 0.33)
  Top 0.152: v21.91,24.45 18.08,20.62 R7.1 17.94,19.68 17.3,19.05 17.3,17.14 PH-OLED.1
  Bottom 0.152: IC1.41 21.97,24.52 v21.91,24.45
POS_1  (via drill 0.33)
  Top 0.152: SW1.4 24.14,6.18 23.18,7.14 21.43,7.14 19.68,8.89 19.68,9.6 17.7,11.59 15.72,11.59 11.91,15.4 11.91,20.8 v12.54,21.43
  Bottom 0.152: IC1.3 13.12,22.02 v12.54,21.43
POS_2  (via drill 0.33)
  Top 0.152: SW1.1 19.04,11.12 18.1,12.07 15.72,12.07 12.22,15.56 12.22,20.16 v12.54,20.48
  Bottom 0.152: IC1.2 13.58,21.52 v12.54,20.48
POS_3  (via drill 0.33)
  Top 0.152: SW1.2 | SW1.2 17.14,11.11 15.72,11.11 11.59,15.24 11.59,21.43 v12.54,22.38
  Bottom 0.152: IC1.4 12.67,22.52 v12.54,22.38
POS_4  (via drill 0.33)
  Top 0.152: v12.7,26.51 10.95,24.77 10.95,14.92 15.72,10.16 16.19,10.16 16.83,9.53 16.83,9.45 SW1.3
  Bottom 0.152: IC1.11 13.51,26.02 13.02,26.51 v12.7,26.51
POS_5  (via drill 0.33)
  Top 0.152: SW1.6 21.92,4.27 21.11,5.08 21.11,6.83 19.37,8.57 18.65,8.57 16.59,10.64 15.72,10.64 11.27,15.08 11.27,24.61 12.22,25.56 v12.7,25.56
  Bottom 0.152: IC1.10 12.74,25.52 v12.7,25.56
SER_UART4_RX  (via drill 0.33)
  Top 0.152: PH-BOTCONMAIN.2 26.35,2.54 26.35,7.14 26.04,7.46 26.04,10.64 22.38,14.29 22.38,16.67 v21.43,17.62
  Bottom 0.152: IC1.53 21.75,17.94 v21.43,17.62
SER_UART4_TX  (via drill 0.33)
  Top 0.152: PH-BOTCONMAIN.1 26.67,2.22 26.67,7.3 26.35,7.62 26.35,10.79 22.7,14.45 22.7,16.83 22.38,17.14 v22.38,17.94
  Bottom 0.152: IC1.52 22.25,18.07 v22.38,17.94
SPI1_CS  (via drill 0.33)
  Top 0.152: v15.72,31.43 15.4,31.75 15.4,35.72 v13.81,37.31
  Bottom 0.152: IC1.17 16.25,30.9 v15.72,31.43 | v13.81,37.31 8.41,42.7 5,42.7 U$1.19
SPI1_MISO
  Bottom 0.152: IC1.20 17.75,31.3 9.84,39.21 4.69,39.21 U$1.16
SPI1_MOSI
  Bottom 0.152: IC1.21 18.25,31.28 9.37,40.16 5,40.16 U$1.17
SPI1_SCK  (via drill 0.33)
  Top 0.152: v9.21,38.58 v6.51,41.27
  Bottom 0.152: IC1.19 17.25,31.33 10,38.58 v9.21,38.58 | v6.51,41.27 6.19,41.59 4.97,41.59 U$1.18
SPI2_CS
  Bottom 0.152: IC1.39 27.42,25.52 30.64,28.73 30.64,36.67 24.45,42.86 21.04,42.86 U$2.19
SPI2_MISO
  Bottom 0.152: IC1.36 27.49,27.02 29.69,29.21 29.69,35.24 26.67,38.26 26.67,38.73 26.04,39.37 22.38,39.37 22.22,39.21 21.59,39.21 21.53,38.99 U$2.16
SPI2_MOSI
  Bottom 0.152: IC1.37 27.47,26.52 30,29.05 30,35.4 27.3,38.1 27.3,38.73 26.35,39.69 23.54,39.69 22.91,40.32 20.95,40.32 21.1,40.18 U$2.17
SPI2_SCK  (via drill 0.33)
  Top 0.152: v25.88,38.58 v23.81,40.64
  Bottom 0.152: IC1.35 27.51,27.52 29.37,29.37 29.37,35.08 v25.88,38.58 | v23.81,40.64 22.86,41.59 21.16,41.59 U$2.18
SWCLK
  Bottom 0.152: IC1.50 23.25,18.18 23.81,17.62 24.61,17.62 25.08,17.14 28.1,17.14 PH-SWD.2
SWDIO
  Bottom 0.152: IC1.49 23.75,18.32 24.13,17.94 24.76,17.94 25.24,17.46 27.94,17.46 29.05,18.57 29.05,20.64 PH-SWD.4
SX1_BUSY
  Bottom 0.152: IC1.14 12.81,27.52 11.27,29.05 11.27,34.77 9.68,36.35 6.24,36.35 5.92,36.67 4.76,36.67 U$1.14
  Bottom 0.406: U$1.14
SX1_DIO
  Bottom 0.152: IC1.13 13.31,27.02 13.18,27.15 12.7,27.15 10.95,28.89 10.95,34.61 9.53,36.04 6.35,36.04 5.71,35.4 5.13,35.4 U$1.13
SX1_RESET
  Bottom 0.152: IC1.18 16.75,31.35 10.16,37.94 4.84,37.94 U$1.15
SX1_RX_EN
  Bottom 0.152: U$1.6 18.81,40.32 17.62,40.32 15.72,38.42 15.72,34.29 18.75,31.25 IC1.22
SX1_TX_EN
  Bottom 0.152: IC1.23 19.25,31.23 16.03,34.45 16.03,38.26 16.99,39.21 18.81,39.21 U$1.7
SX2_BUSY
  Bottom 0.152: IC1.34 27.54,28.02 29.05,29.53 29.05,34.92 27.3,36.67 21.35,36.67 U$2.14
SX2_DIO
  Bottom 0.152: IC1.24 19.75,31.18 20.32,31.75 21.91,31.75 23.81,33.66 23.81,34.61 23.02,35.4 21.19,35.4 U$2.13
SX2_RESET  (via drill 0.33)
  Top 0.152: v28.42,37.94 v23.81,37.94
  Bottom 0.152: IC1.38 27.44,26.02 30.32,28.89 30.32,36.04 v28.42,37.94 | v23.81,37.94 21.32,37.94 U$2.15
SX2_RX_EN
  Bottom 0.152: IC1.45 27.44,22.52 27.78,22.86 27.78,24.92 31.27,28.42 31.27,37.62 33.97,40.32 35.2,40.32 U$2.6
SX2_TX_EN
  Bottom 0.152: IC1.46 27.41,22.02 28.1,22.7 28.1,24.77 31.59,28.26 31.59,37.46 33.34,39.21 35.16,39.21 U$2.7
UART2_TX
  Bottom 0.152: IC1.56 20.25,17.87 19.84,17.46 19.84,15.24 18.73,14.13 D1.A
USB_UART1_RX  (via drill 0.33)
  Top 0.152: v27.15,23.18 27.78,23.81 33.66,23.81 PH-BOTCON2.2
  Bottom 0.152: IC1.44 26.98,23.02 v27.15,23.18
USB_UART1_TX  (via drill 0.33)
  Top 0.152: v27.15,24.13 32.7,24.13 PH-BOTCON2.1
  Bottom 0.152: IC1.43 26.53,23.52 v27.15,24.13

### Text on the board
tNames: mLRS | v0.31 / rev00 | DBG | 3.3V | Tx | Rx | GND | (c) www.olliw.eu | G | SWD | G | OLED | BOOT | BUT | SDA | SCL | 3.3 | GND | mLRS | (c) olliw | G
bNames: E22 #1 | E22 #2 | SWD | 3.3V | G